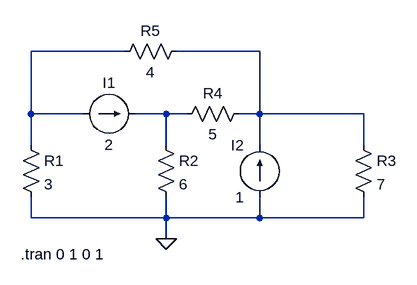
[diagram p0: schematic Circuit_9.asc]
Circuit_9.asc, the LTspice schematic file:
Version 4.1
SHEET 1 880 680
WIRE 112 32 -32 32
WIRE 320 32 192 32
WIRE -32 128 -32 32
WIRE 48 128 -32 128
WIRE 176 128 128 128
WIRE 208 128 176 128
WIRE 320 128 320 32
WIRE 320 128 288 128
WIRE 480 128 320 128
WIRE -32 176 -32 128
WIRE 176 176 176 128
WIRE 320 176 320 128
WIRE 480 176 480 128
WIRE -32 288 -32 256
WIRE 176 288 176 256
WIRE 176 288 -32 288
WIRE 320 288 320 256
WIRE 320 288 176 288
WIRE 480 288 480 256
WIRE 480 288 320 288
WIRE 176 320 176 288
FLAG 176 320 0
SYMBOL current 48 128 R270
WINDOW 0 32 40 VTop 2
WINDOW 3 -32 40 VBottom 2
WINDOW 123 0 0 Left 0
WINDOW 39 0 0 Left 0
SYMATTR InstName I1
SYMATTR Value 2
SYMBOL current 320 256 R180
WINDOW 0 24 80 Left 2
WINDOW 3 24 0 Left 2
WINDOW 123 0 0 Left 0
WINDOW 39 0 0 Left 0
SYMATTR InstName I2
SYMATTR Value 1
SYMBOL res -48 160 R0
SYMATTR InstName R1
SYMATTR Value 3
SYMBOL res 160 160 R0
SYMATTR InstName R2
SYMATTR Value 6
SYMBOL res 464 160 R0
SYMATTR InstName R3
SYMATTR Value 7
SYMBOL res 304 112 R90
WINDOW 0 0 56 VBottom 2
WINDOW 3 32 56 VTop 2
SYMATTR InstName R4
SYMATTR Value 5
SYMBOL res 208 16 R90
WINDOW 0 0 56 VBottom 2
WINDOW 3 32 56 VTop 2
SYMATTR InstName R5
SYMATTR Value 4
TEXT -48 344 Left 2 !.tran 0 1 0 1

The netlist it stands for:
* Circuit_9.asc
I1 N001 N003 2
I2 0 N002 1
R1 N001 0 3
R2 N003 0 6
R3 N002 0 7
R4 N002 N003 5
R5 N002 N001 4
.tran 0 1 0 1
.backanno
.end